# Altium schematic sheet SCH-11-Out Going Connectors.SchDoc
size A4
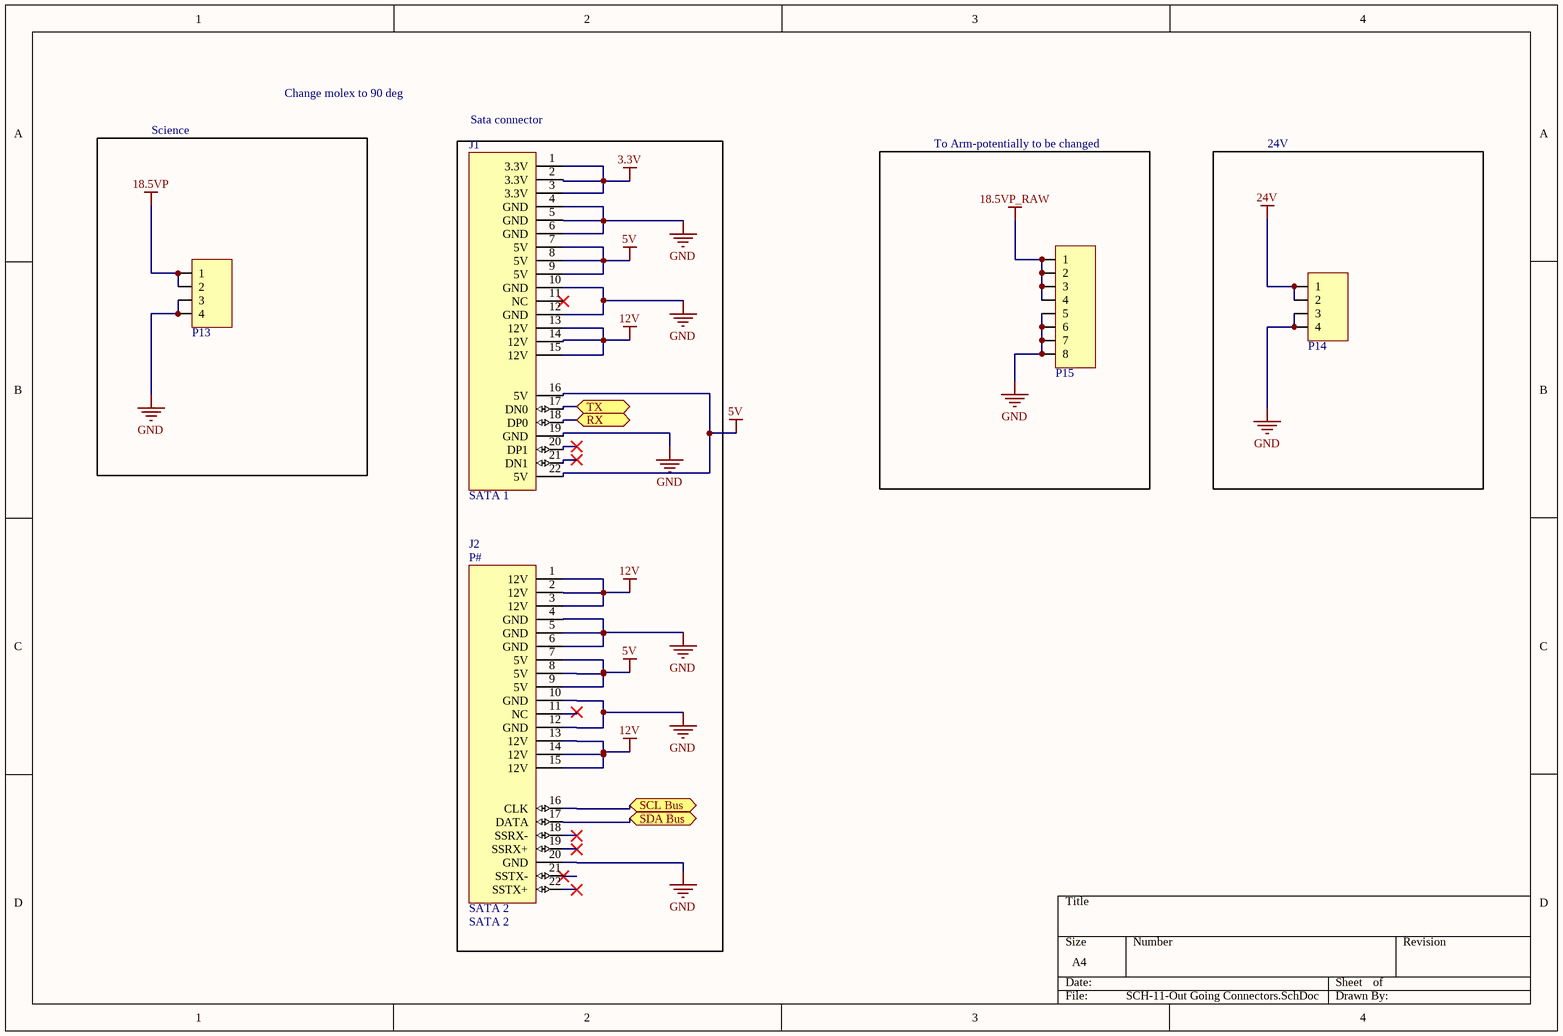
[diagram p0: SCH-11-Out Going Connectors.SchDoc]

## Parts
J1  SATA 1  [SATA Female]
J2  SATA 2  [SATA Female]
P13  Mini-Fit Jr 4 Pos  [MOLEX 0039281043]  (value not drawn)
P14  Mini-Fit Jr 4 Pos  [MOLEX 0039281043]  (value not drawn)
P15  Mini-Fit Jr 8 Pos RA  [MOLEX 172065-0208]  (value not drawn)

## Blocks framed on the sheet
Science: P13
Sata connector: J1 J2
To Arm-potentially to be changed: P15
24V: P14

## Ports
RX (bidir), SCL Bus (bidir), SDA Bus (bidir), TX (bidir)

## Nets
3.3V: J1.1(3.3V) J1.2(3.3V) J1.3(3.3V)
5V: J1.7(5V) J1.8(5V) J1.9(5V) J1.16(5V) J1.22(5V) J2.7(5V) J2.8(5V) J2.9(5V)
12V: J1.13(12V) J1.14(12V) J1.15(12V) J2.1(12V) J2.2(12V) J2.3(12V) J2.13(12V) J2.14(12V) J2.15(12V)
18.5VP: P13.1 P13.2
18.5VP_RAW: P15.1 P15.2 P15.3 P15.4
24V: P14.1 P14.2
GND: J1.4(GND) J1.5(GND) J1.6(GND) J1.10(GND) J1.12(GND) J1.19(GND) J2.4(GND) J2.5(GND) J2.6(GND) J2.10(GND) J2.12(GND) J2.20(GND) P13.3 P13.4 P14.3 P14.4 P15.5 P15.6 P15.7 P15.8
RX: J1.18(DP0) ; port RX
SCL Bus: J2.16(CLK) ; port SCL Bus
SDA Bus: J2.17(DATA) ; port SDA Bus
TX: J1.17(DN0) ; port TX

Not connected (* = marked no-connect by the designer): J1 11(NC)* 20(DP1)* 21(DN1)*; J2 11(NC)* 18(SSRX-)* 19(SSRX+)* 21(SSTX-)* 22(SSTX+)*

## Notes on the sheet
- Change molex to 90 deg
- (in symbol SATA 2) P#

## Library data of the parts
J1 = SATA 1: SATA connector. / Connector 1 for option 1 as per Spec; Supplier 1: Digi-Key
J2 = SATA 2: SATA connector. / Connector 2 for option 1 as per Spec; Supplier 1: Digi-Key
P13 P14 = Molex 0039281043: Mini-Fit Jr. Header, Dual Row, Right-Angle, with Snap-in Plastic Peg PCB Lock, 6 Circuits, PA Polyamide Nylon 6/6 94V-2, 0.76µm Select Gold (Au) Plating
P15 = Molex Mega-Fit 8pos Vert: Mega-Fit, 8 pos 2 row